# Altium project Modulo_Led_RGB.PrjPcb
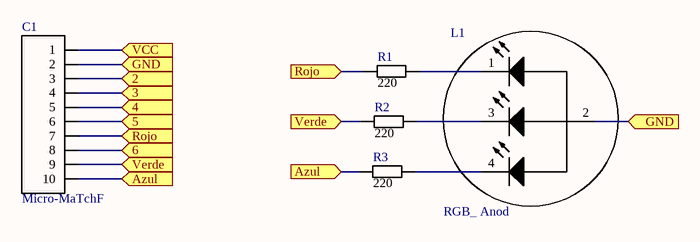
[diagram p0: Modulo_Led_RGB.SchDoc]
1 sheet, 5 parts. Net scope: flat (ports and power ports of the same name join across sheets).
Board file: Modulo_Led_RGB.PcbDoc

## Sheet Modulo_Led_RGB.SchDoc
size A4

### Parts
C1  Micro-MaTchF  [Micro-MaTch Famale 1.27mm/SMD]
L1  RGB_ Anod  [Led 5mm - RGB]
R1  value 220  [1206 (3216)]  (hidden comment: Res)
R2  value 220  [1206 (3216)]  (hidden comment: Res)
R3  value 220  [1206 (3216)]  (hidden comment: Res)

### Ports
2 (in), 3 (in), 4 (in), 5 (in), 6 (in), Azul (in), GND (in), Rojo (in), VCC (in), Verde (in)

### Nets
NetC1_1: C1.1 ; port VCC
NetC1_2: C1.2 L1.2(K) ; port GND
NetC1_3: C1.3 ; port 2
NetC1_4: C1.4 ; port 3
NetC1_5: C1.5 ; port 4
NetC1_6: C1.6 ; port 5
NetC1_7: C1.7 R1.1 ; port Rojo
NetC1_8: C1.8 ; port 6
NetC1_9: C1.9 R2.1 ; port Verde
NetC1_10: C1.10 R3.1 ; port Azul
NetL1_1: L1.1(A) R1.2
NetL1_3: L1.3(A) R2.2
NetL1_4: L1.4(A) R3.2

### Library data of the parts
C1 = Micro-MaTchF: Micro-MaTch Famale 1.27mm T/Hole
L1 = RGB_ Anod: Typical BLUE SiC LED
R1-R3 = Res2: Resistor; Autor: Borxo García